# EasyEDA Pro project 2810_driverBoard.eprj

# Schematic Schematic1
Create Date: 2024-07-02; Page Name: P1; Project Name: 2810_driverBoard; Schematic Name: Schematic1; Update Date: 2024-07-02; Company: 嘉立创EDA; Page Size: A4; Version: V1.0
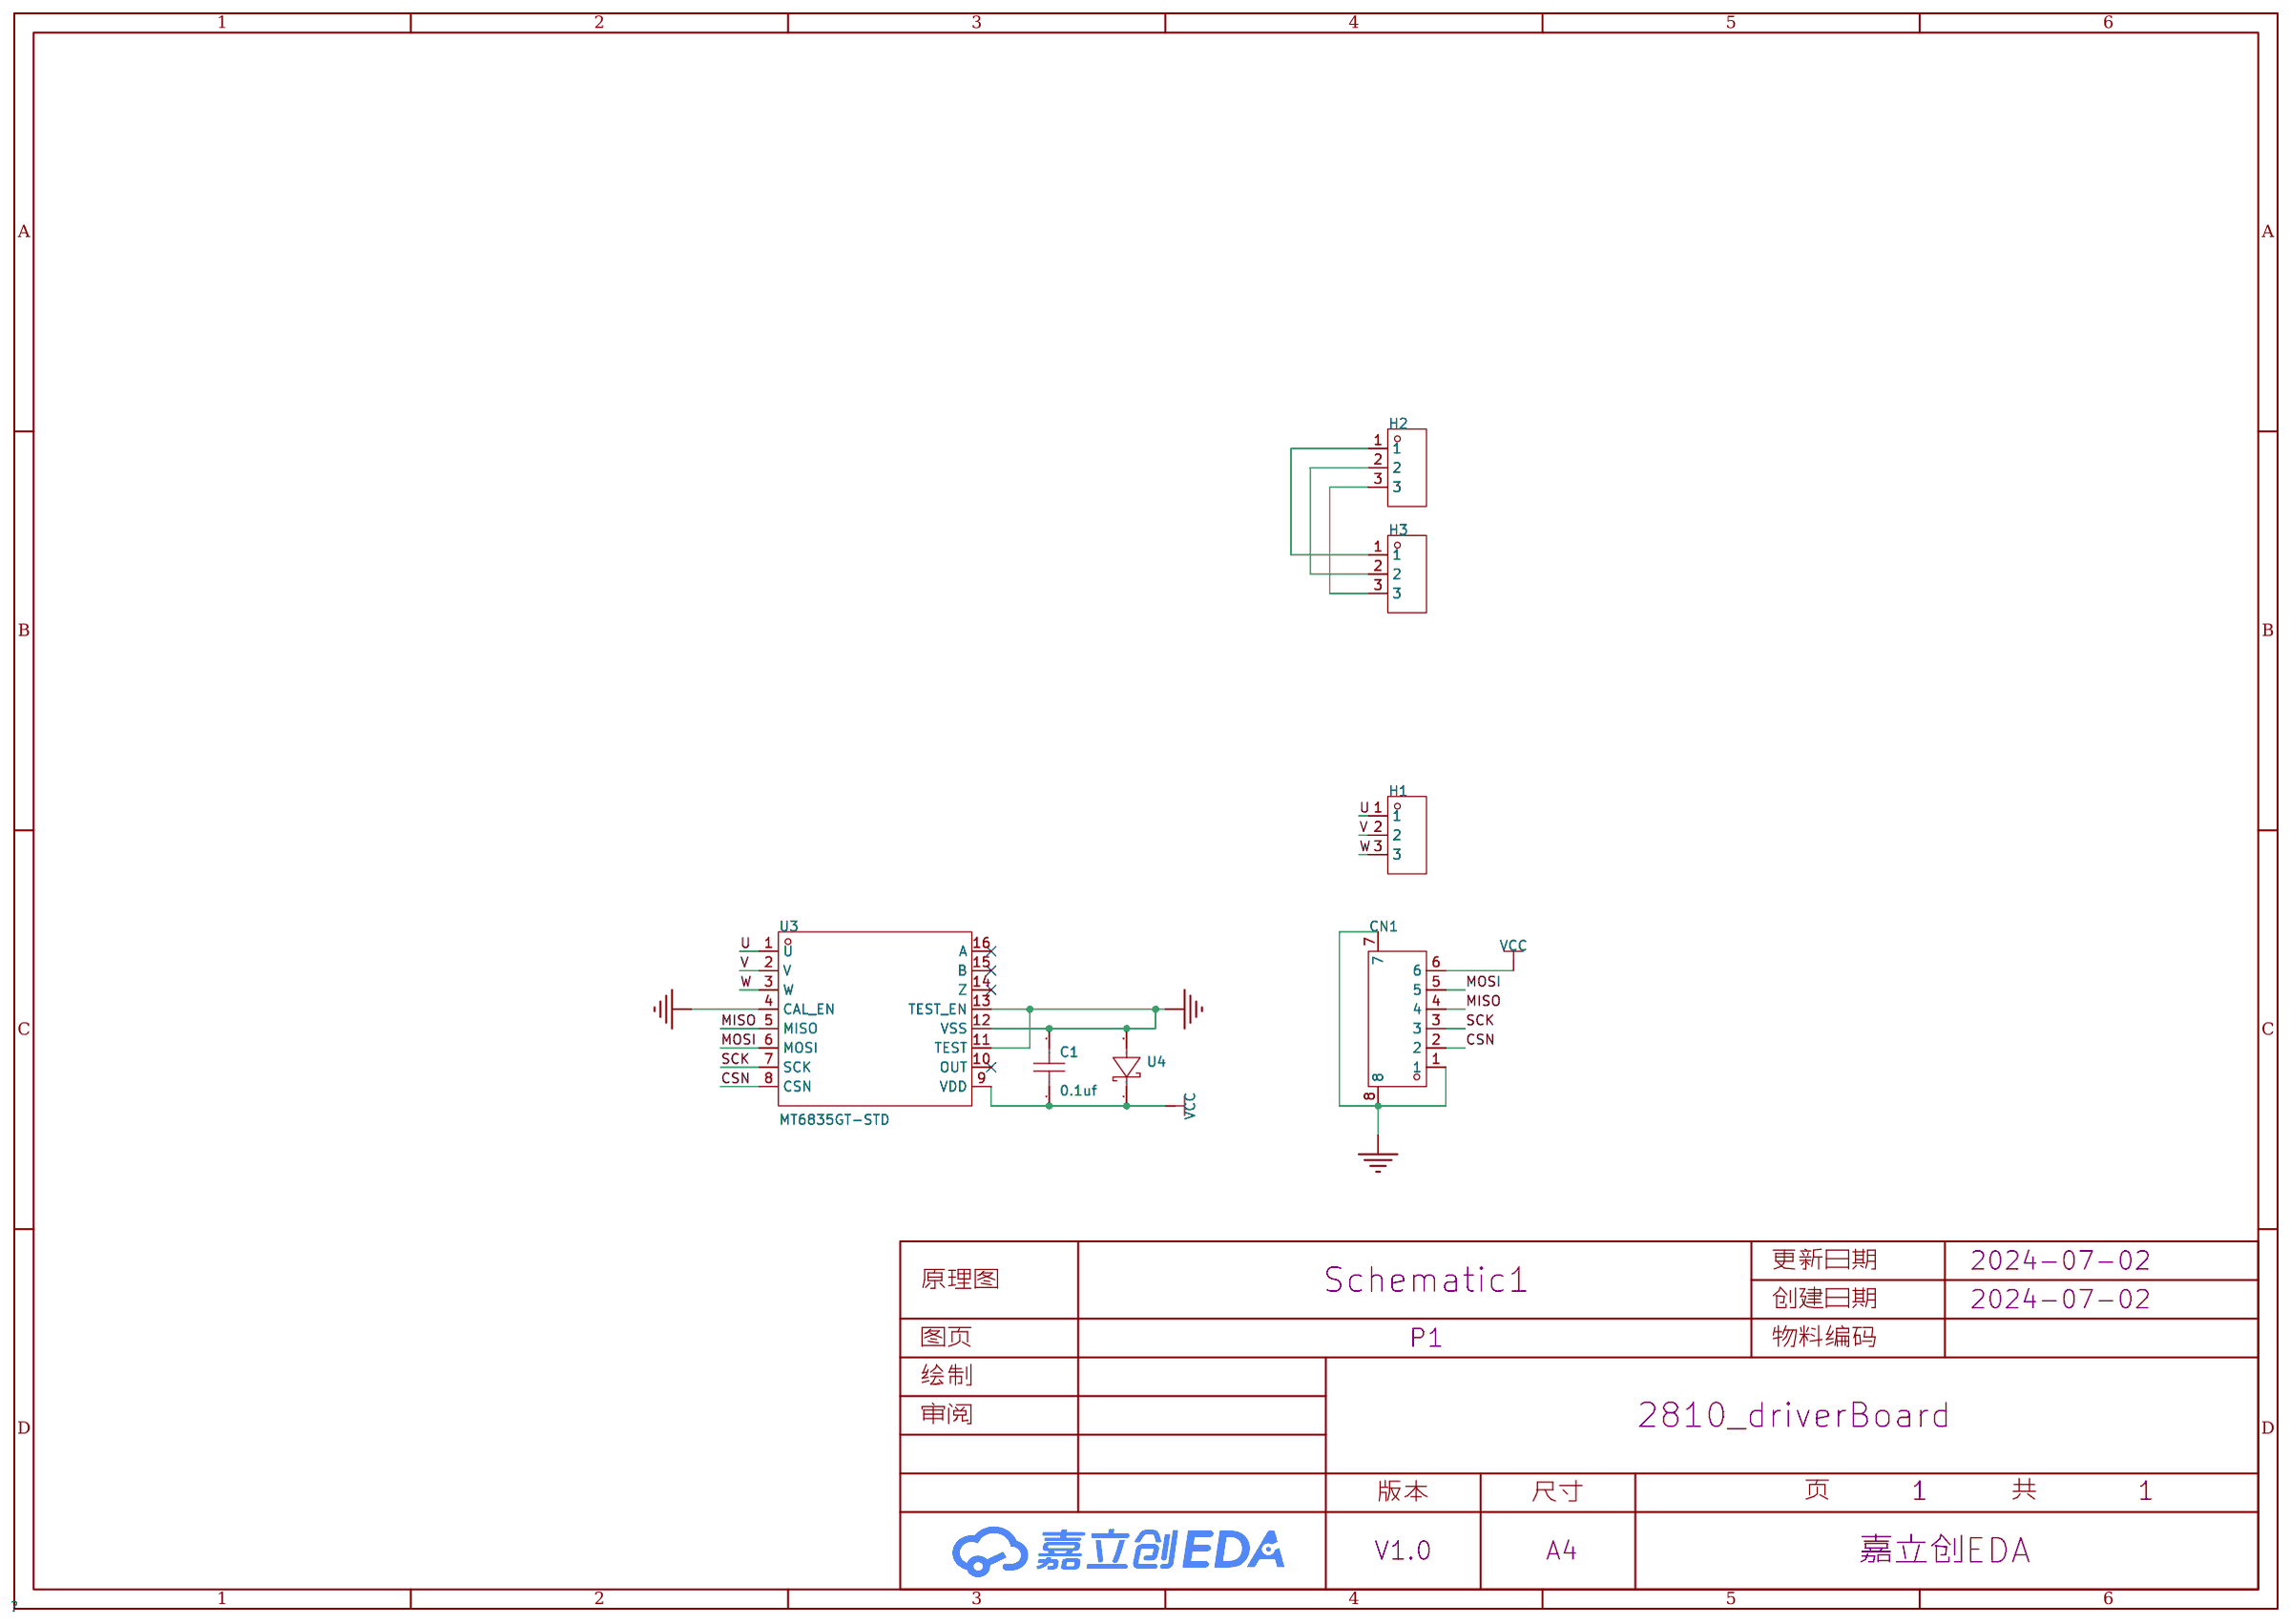
[diagram p0: schematic sheet]

## Parts
C1  0.1uf  [C0603]
CN1  M1010RS-06P  [CONN-SMD_M1010RS-06P]
H1  PZ254V-11-03P  [3P_2.54mm]
H2  PZ254V-11-03P  [3P_2.54mm]
H3  PZ254V-11-03P  [3P_2.54mm]
U3  MT6835GT-STD  [TSSOP-16_L5.0-W4.4-P0.65-LS6.4-BL]
U4  PTVS6V0S1UR  [SOD-123_L2.7-W1.6-LS3.7-RD]

## Library data of the parts
C1 = CAP_0603: Supplier Footprint: 0603
CN1 = M1010RS-06P: 插针结构:1x6P;间距:1mm;安装方式:卧贴;参考系列:-;总PIN数:6P;排数:1;每排PIN数:6;行距:-;额定电流:1A;工作温度范围:-25℃~+85℃;; LCSC Part Name: 1x6P 间距:1mm 卧贴; Supplier Part: C541848; Manufacturer: XFCN(兴飞); Supplier Footprint: SMD,P=1mm,卧贴; JLCPCB Part Class: 扩展库; Datasheet: https://atta.szlcsc.com/upload/public/pdf/source/20200518/C541847_4FBBB7CE1CCFE042AF6DD43CBAA42E89.pdf; Supplier: LCSC; Pins Structure: 1x6P; Pitch: 1mm; Mounting Style: 卧贴; Number of Pins: 6P; Number of Rows: 1; Number of PINs Per Row: 6; Current Rating (Max): 1A; Operating Temperature Range: -25℃~+85℃
H1-H3 = PZ254V-11-03P: 插针结构:1x3P;间距:2.54mm;行距:-;圆针/方针:方针;安装类型:直插;排数:单排;总PIN位数:3P;额定电流:3A;额定电压:250V;配合针长度:6mm;塑高:2.5mm;端接针长度:3mm;工作温度范围:-40℃~+105℃;颜色:黑色;; LCSC Part Name: 间距:2.54mm 1x3P 直插 方针; Supplier Part: C2937625; Manufacturer: XFCN(兴飞); Supplier Footprint: 插件,P=2.54mm; JLCPCB Part Class: 扩展库; Datasheet: https://atta.szlcsc.com/upload/public/pdf/source/20200309/C492402_8335C3D49C4E4C618838D59BB1D024C1.pdf; Supplier: LCSC; Pin Structure: 1x3P; Pitch: 2.54mm; Circluar Pins/Square Pins: 方针; Mounting Type: 直插; Number of Rows: 单排; Number of Pins: 3P; Current Rating (Max): 3A; Voltage Rating (Max): 250V; Length of Mating Pin: 6mm; Insulation Height: 2.5mm; Length of End Connection Pin: 3mm; Operating Temperature Range: -40℃~+105℃; Color: 黑色
U3 = MT6835GT-STD: Supplier Part: C2932578; Manufacturer: MagnTek(麦歌恩); Supplier Footprint: TSSOP-16; JLCPCB Part Class: 扩展库; Datasheet: https://atta.szlcsc.com/upload/public/pdf/source/20220401/418F299D566A154DD9BD1E08440FF187.pdf; Supplier: LCSC
U4 = PTVS6V0S1UR: 极性:单向;反向截止电压(Vrwm):6V;最大钳位电压:10.3V;峰值脉冲电流(Ipp)@10/1000us:38.8A;峰值脉冲功率(Ppp)@10/1000us:400W;击穿电压:6.67V;; Supplier Part: C18723426; Manufacturer: FUXINSEMI(富芯森美); Supplier Footprint: SOD-123; JLCPCB Part Class: Extended Part; Datasheet: https://atta.szlcsc.com/upload/public/pdf/source/20240115/1F327C98E07612BCEC3AECE7F1FF94CE.pdf; Supplier: LCSC; polarity: 单向; Reverse Stand-Off Voltage (Vrwm): 6V; Maximum Clamping Voltage: 10.3V; Peak Pulse Current (Ipp)@10/1000us: 38.8A; Peak Pulse Power Dissipation (Ppp)@10/1000us: 400W; Breakdown Voltage: 6.67V; Reverse Leakage Current (Ir): 400uA; Number of Lines: 单路; Type: TVS

## Nets
GND: C1.2 CN1.1 CN1.7 CN1.8 U3.4(CAL_EN) U3.11(TEST) U3.12(VSS) U3.13(TEST_EN) U4.2(A)
VCC: C1.1 CN1.6 U3.9(VDD) U4.1(K)
CSN: CN1.2 U3.8(CSN)
MISO: CN1.4 U3.5(MISO)
MOSI: CN1.5 U3.6(MOSI)
SCK: CN1.3 U3.7(SCK)
U: H1.1 U3.1(U)
V: H1.2 U3.2(V)
W: H1.3 U3.3(W)
$1N838: H2.1 H3.1
$1N843: H2.2 H3.2
$1N848: H2.3 H3.3

Not connected (* = marked no-connect by the designer): U3 10(OUT)* 14(Z)* 15(B)* 16(A)*

# Board PCB1
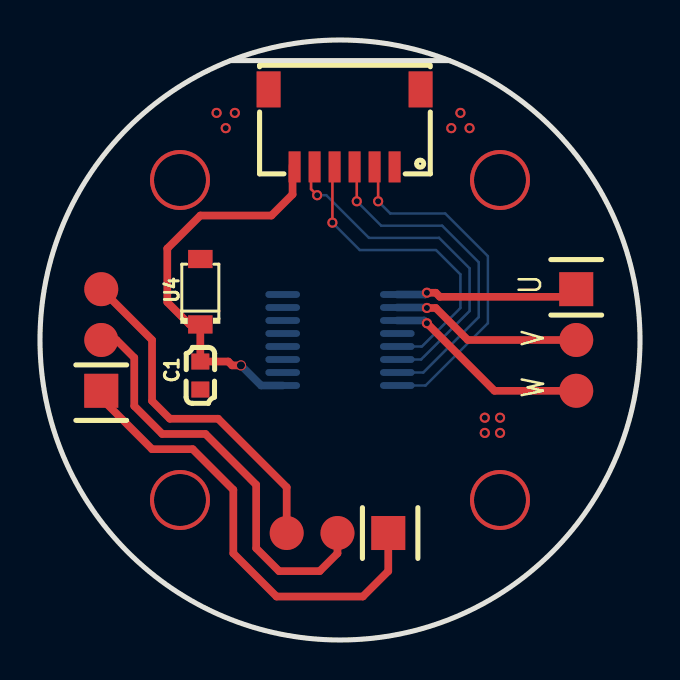
[diagram p1: board, top side]
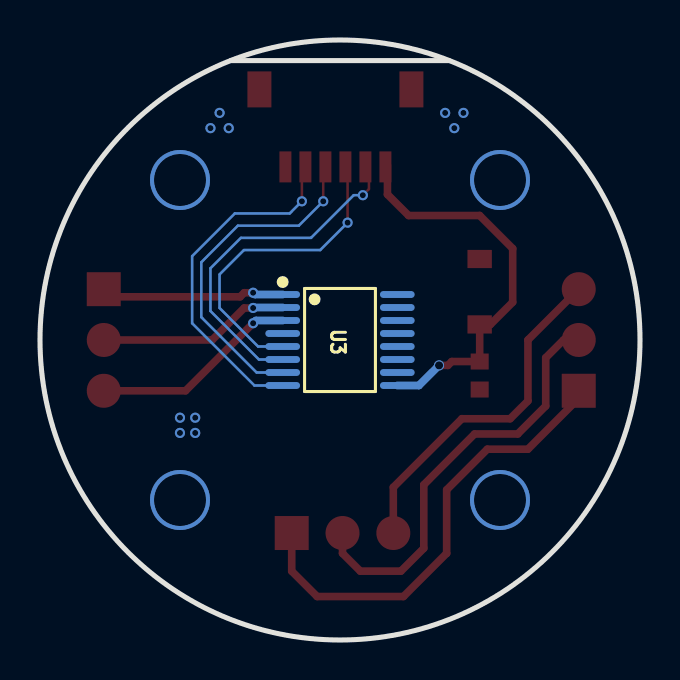
[diagram p2: board, bottom side, seen from below]

Outline 30 x 30 mm; copper layers: Top Layer, Bottom Layer. Coordinates in mm from the lower left corner of the outline.
Outline path: circle c15,15 r15 ; 9.55,28.97 20.46,28.97
Stack: Top Layer 0.035mm / Dielectric1 1.51mm FR4 er 4.5 / Bottom Layer 0.035mm

## Design rules (mm)
template: 自定义配置
spacing copperThickness1oz (default): track to track 0.102, other pairs 0 to 0.3
spacing copperThickness2oz: track to track 0.203, other pairs 0.152 to 0.3
track width copperThickness1oz (default): min 0.127, default 0.254, max 2.54
track width copperThickness2oz: min 0.203, default 0.254, max 2.54
differential pair differentialPair (default): width min 0.127, default 0.254, max 2.54; gap min 0.152, default 0.152
via viaSize (default): diameter min 0.5, default 0.61, max 10; hole min 0.3, default 0.305, max 6.299

## Placement (name value [footprint] x y rotation side)
C1  0.1uf  [C0603]  8.02 13.22 270 top
CN1  M1010RS-06P  [CONN-SMD_M1010RS-06P]  15.23 25.59 180 top
H1  PZ254V-11-03P  [3P_2.54mm]  26.81 15 270 top
H2  PZ254V-11-03P  [3P_2.54mm]  3.06 15 90 top
H3  PZ254V-11-03P  [3P_2.54mm]  14.87 5.35 180 top
U3  MT6835GT-STD  [TSSOP-16_L5.0-W4.4-P0.65-LS6.4-BL]  15 15 270 bottom
U4  PTVS6V0S1UR  [SOD-123_L2.7-W1.6-LS3.7-RD]  8.02 17.41 90 top

## Footprints (pads in the part's own frame, mm; a bottom-side part is the same pattern mirrored in y, then rotated)
3P_2.54mm
  rect 1.7x1.7 smd: 1(-2.54,0)
  round 1.7 smd: 2(0,0) 3(2.54,0)
C0603
  rect 0.8x0.9 smd: 1(-0.7,0) 2(0.7,0)
CONN-SMD_M1010RS-06P
  rect 0.6x1.55 smd: 1(-2.5,1.938) 2(-1.5,1.938) 3(-0.5,1.938) 4(0.5,1.938) 5(1.5,1.938) 6(2.5,1.938)
  rect 1.2x1.8 smd: 7(3.8,-1.938) 8(-3.8,-1.938)
SOD-123_L2.7-W1.6-LS3.7-RD
  rect 0.91x1.22 smd: 1(-1.635,0) 2(1.635,0)
TSSOP-16_L5.0-W4.4-P0.65-LS6.4-BL
  oval 0.343x1.732 smd: 1(-2.275,-2.866) 2(-1.625,-2.866) 3(-0.975,-2.866) 4(-0.325,-2.866) 5(0.325,-2.866) 6(0.975,-2.866) 7(1.625,-2.866) 8(2.275,-2.866) 9(2.275,2.866) 10(1.625,2.866) 11(0.975,2.866) 12(0.325,2.866) 13(-0.325,2.866) 14(-0.975,2.866) 15(-1.625,2.866) 16(-2.275,2.866)

## Nets
As in the schematic.

Pads without a net: U3 10 14 15 16

## Via types
v1: diameter 3, hole 2.6, Top Layer to Bottom Layer, 4 vias
v2: diameter 0.508, hole 0.305, Top Layer to Bottom Layer, 17 vias
v3: diameter 0.508, hole 0.406, Top Layer to Bottom Layer, 1 via

## Routing (per net, layer and track width the routed paths; a pad name or vN(x,y) marks a point on that pad's centre or on a via; arc(x,y) is an arc through that point)
GND:
  vias: v2(8.83,26.36) v2(9.29,25.59) v2(9.74,26.36) v2(20.56,25.59) v2(21.02,26.36) v2(21.48,25.59) v2(22.24,11.11) v2(22.24,10.35) v2(23,11.11) v2(23,10.35)
VCC: length 20.1
  Top Layer w0.381: 12.63,23.73 12.63,22.28 11.57,21.22 8.02,21.22 6.37,19.57 6.37,16.89 7.48,15.78 U4.1 C1.1 9.41,13.92 9.6,13.73 v3(10.05,13.73)
  Bottom Layer w0.381: U3.9 11.05,12.72 v3(10.05,13.73)
(no net):
  vias: v1(7,23) v1(7,7) v1(23,23) v1(23,7)
CSN: length 17.6
  Top Layer w0.127: CN1.2 16.91,23.48 v2(16.91,21.94)
  Bottom Layer w0.127: U3.8 19.28,12.72 22.39,15.84 22.39,19.19 20.26,21.33 17.52,21.33 v2(16.91,21.94)
MISO: length 15.9
  Top Layer w0.127: CN1.4 14.62,23.55 v2(14.62,20.87)
  Bottom Layer w0.127: v2(14.62,20.87) 15.99,19.5 19.8,19.5 21.02,18.28 21.02,16.6 19.09,14.67 U3.5
MOSI: length 17.5
  Top Layer w0.127: v2(13.86,22.24) 13.55,22.55 13.55,23.48 CN1.5
  Bottom Layer w0.127: U3.6 19.05,14.03 21.48,16.45 21.48,18.58 19.95,20.11 16.45,20.11 14.31,22.24 v2(13.86,22.24)
SCK: length 17.1
  Top Layer w0.127: v2(15.84,21.94) 15.84,23.55 CN1.3
  Bottom Layer w0.127: U3.7 19.17,13.38 21.94,16.14 21.94,18.89 20.11,20.72 17.06,20.72 v2(15.84,21.94)
U: length 9.2
  Top Layer w0.381: v2(19.34,17.36) 19.79,17.36 19.99,17.16 26.43,17.16 26.81,17.54
  Bottom Layer w0.381: v2(19.34,17.36) 19.26,17.28 U3.1
V: length 9.6
  Top Layer w0.381: v2(19.34,16.6) 19.79,16.6 21.39,15 H1.2
  Bottom Layer w0.381: v2(19.34,16.6) 19.32,16.62 U3.2
W: length 10.4
  Top Layer w0.381: H1.3 22.72,12.46 v2(19.34,15.84)
  Bottom Layer w0.381: v2(19.34,15.84) 19.21,15.97 U3.3
$1N838: length 23.1
  Top Layer w0.381: H3.1 17.41,3.44 16.14,2.17 11.83,2.17 9.67,4.33 9.67,7.51 7.63,9.54 5.6,9.54 3.06,12.08 H2.1
$1N843: length 21.3
  Top Layer w0.381: H3.2 14.87,4.33 13.99,3.44 11.95,3.44 10.81,4.59 10.81,7.76 8.27,10.3 6.11,10.3 4.71,11.7 4.71,14.11 3.82,15 H2.2
$1N848: length 17.4
  Top Layer w0.381: 3.06,17.54 5.6,15 5.6,11.95 6.49,11.06 8.91,11.06 12.33,7.64 H3.3

## Copper pours and planes (outline as drawn; the poured copper is in the pictures)
GND on Top Layer: -0.62,31.08 32.91,31.08 32.91,-0.77 -0.62,-0.77
GND on Bottom Layer: -2.6,32.76 34.43,32.76 34.43,-1.69 -2.6,-1.69

## Text on the board
Bottom Solder Mask Layer: MT6835
Top Solder Mask Layer: kjazz0421 | 2810driver_V1.0 | 2024.07.03
Top Silkscreen Layer: U | V | W
